# EAGLE design couch-reg-rc (EAGLE 7.6.0)
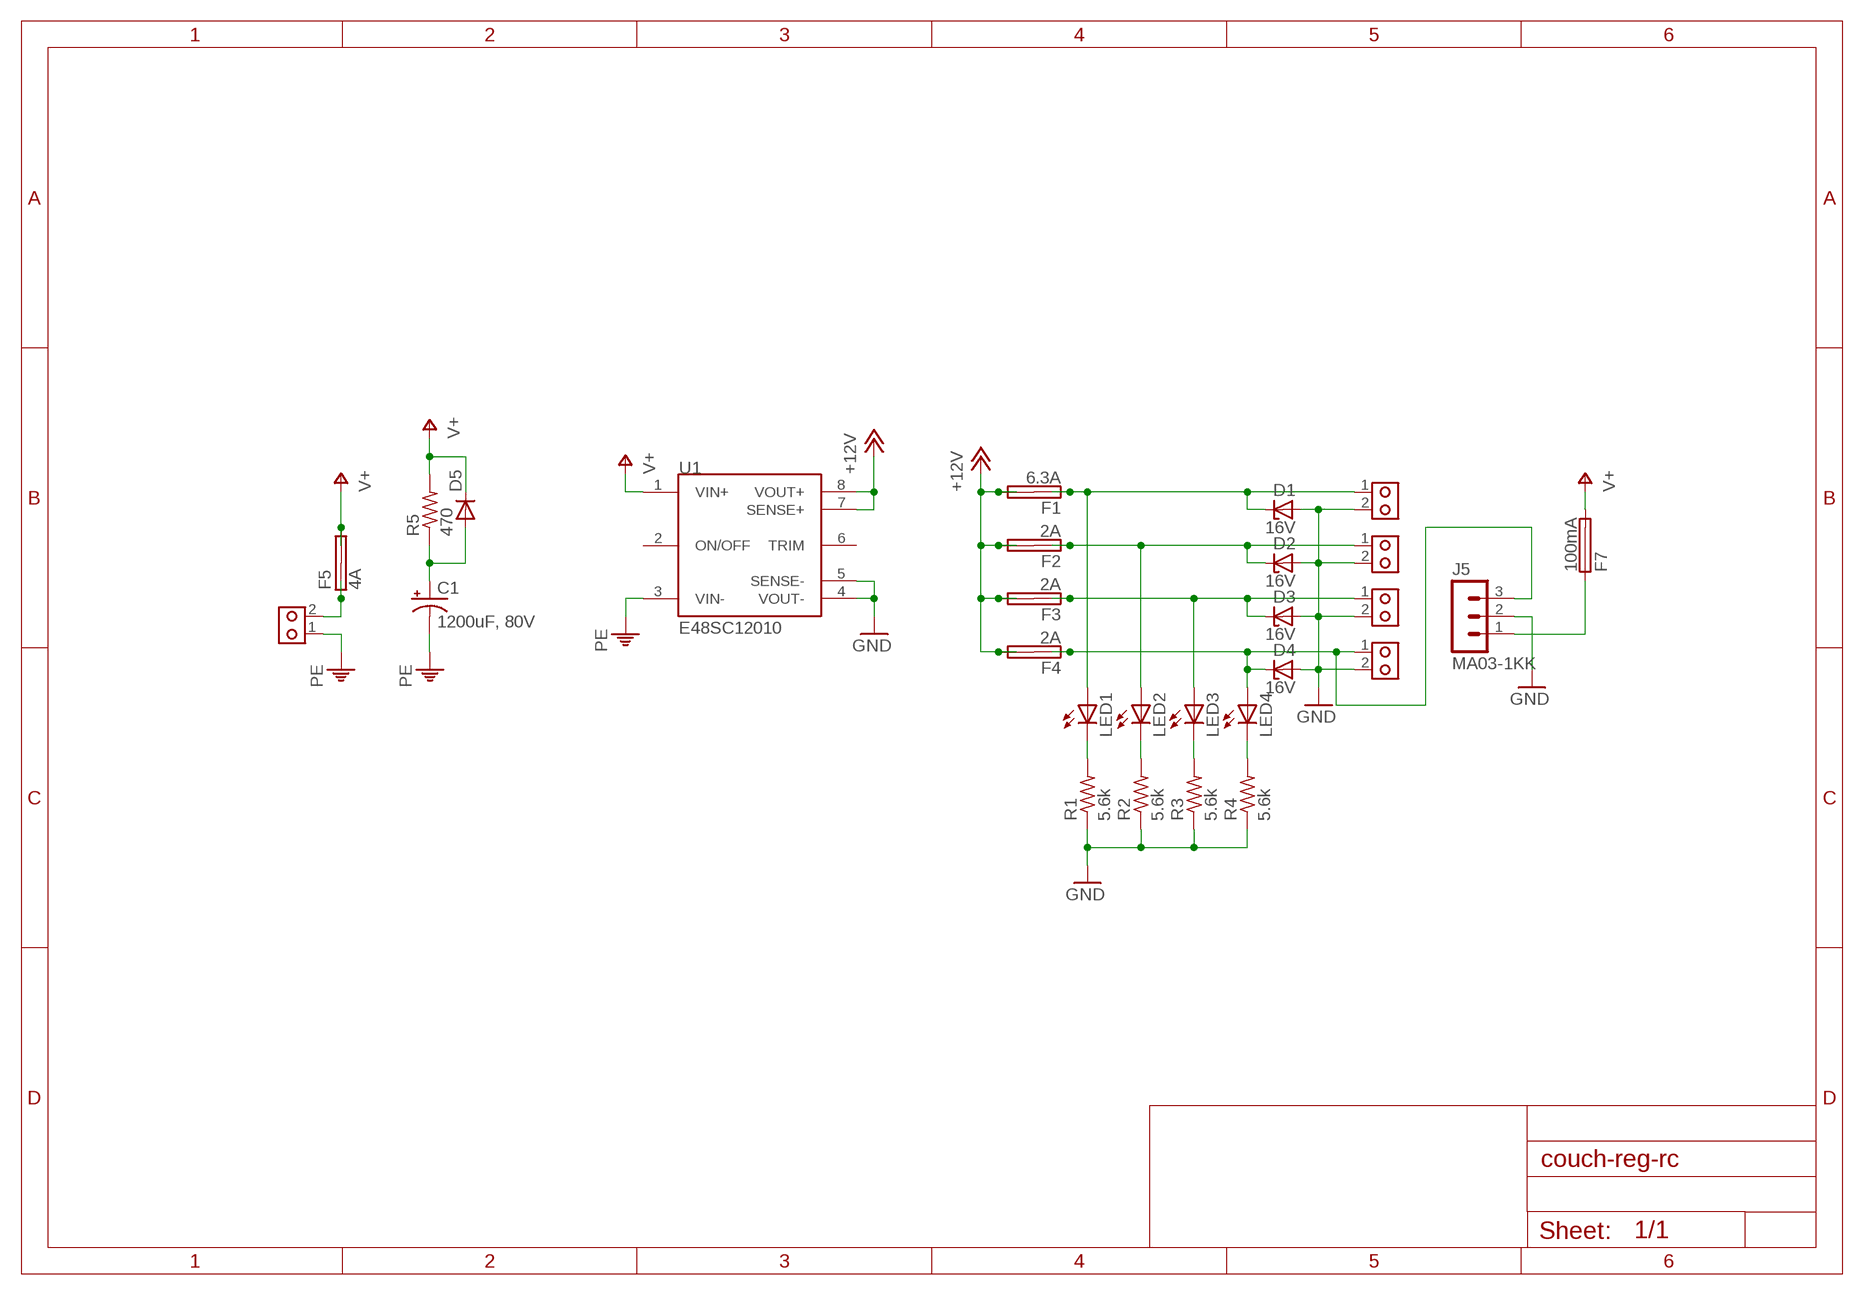
[diagram p0: schematic, sheet 1]

## Parts
C1  1200uF, 80V  CPOL-USE7.5-18  [E7,5-18]
D1  16V  ZENER-DIODEC1702-15  [C1702-15]
D2  16V  ZENER-DIODEC1702-15  [C1702-15]
D3  16V  ZENER-DIODEC1702-15  [C1702-15]
D4  16V  ZENER-DIODEC1702-15  [C1702-15]
D5  DIODE-SMB  [SMB]
F1  6.3A  SHK20L  [SHK20L]
F2  2A  SHK20L  [SHK20L]
F3  2A  SHK20L  [SHK20L]
F4  2A  SHK20L  [SHK20L]
F5  4A  SHK20L  [SHK20L]
F7  100mA  FUSE0603  [0603]
J1  PCBTERM2  [PCBTERM]
J2  PCBTERM2  [PCBTERM]
J3  PCBTERM2  [PCBTERM]
J4  PCBTERM2  [PCBTERM]
J5  MA03-1KK  [MOLEX-3]
J6  PCBTERM2  [PCBTERM]
LED1  LEDCHIPLED_0603  [CHIPLED_0603]
LED2  LEDCHIPLED_0603  [CHIPLED_0603]
LED3  LEDCHIPLED_0603  [CHIPLED_0603]
LED4  LEDCHIPLED_0603  [CHIPLED_0603]
R1  5.6k  R-US_R0603  [R0603]
R2  5.6k  R-US_R0603  [R0603]
R3  5.6k  R-US_R0603  [R0603]
R4  5.6k  R-US_R0603  [R0603]
R5  470  R-US_R0603  [R0603]
U1  E48SC12010  [E48SC12010]

## Nets
+12V: F1.2A F1.2B F2.2A F2.2B F3.2A F3.2B F4.2A F4.2B U1.7(SENSE+) U1.8(VOUT+)
GND: D1.A D2.A D3.A D4.A J1.2 J2.2 J3.2 J4.2 J5.2 R1.1 R2.1 R3.1 R4.1 U1.4(VOUT-) U1.5(SENSE-)
N$1: C1.+ D5.A R5.1
N$2: D4.C F4.1A F4.1B J4.1 J5.3 LED4.A
N$3: D1.C F1.1A F1.1B J1.1 LED1.A
N$4: D2.C F2.1A F2.1B J2.1 LED2.A
N$5: D3.C F3.1A F3.1B J3.1 LED3.A
N$7: F7.1 J5.1
N$8: LED1.C R1.2
N$9: LED2.C R2.2
N$10: LED3.C R3.2
N$11: LED4.C R4.2
N$12: F5.1A F5.1B J6.2
PE: C1.- J6.1 U1.3(VIN-)
V+: D5.C F5.2A F5.2B F7.2 R5.2 U1.1(VIN+)
Unconnected: U1.2(ON/OFF) U1.6(TRIM)

## Library data of the parts
C1 = resistor:CPOL-US: POLARIZED CAPACITOR, American symbol
D1-D4 = diode:ZENER-DIODE: Z-Diode
D5 = diode:DIODE-: DIODE
F1-F5 = fuse:SHK20L: FUSE HOLDER 5 x 20 mm, SH contact, SHH1 Schukat, E1073 Buerklin; OC_FARNELL: unknown; OC_NEWARK: unknown
F7 = william:FUSE
J1-J4 J6 = william:PCBTERM2
J5 = william:MA03-1
LED1-LED4 = led:LED: LED OSRAM: - CHIPLED LG R971, LG N971, LY N971, LG Q971, LY Q971, LO R971, LY R971 LH N974, LH R974 LS Q976, LO Q976, LY Q976 LO Q996 - Hyper CHIPLED LW Q18S LB Q993, LB Q99A, LB R99A - SideLED LS A670, LO A670, LY A670, LG A670, LP A670 LB A673, LV A673, LT A673, LW A673 LH A674 LY A675 LS A676, LA A676, LO A676, LY A676, LW A676 LS A679, LY A679, LG A679 - Hyper Micro SIDELED® LS Y876, LA Y876, LO Y876, LY Y876 LT Y87S - SmartLED LW L88C, LW L88S LB L89C, LB L89S, LG L890 LS L89K, LO L89K, LY L89K LS L896, LA L896, LO L896, LY L896 - TOPLED LS T670, LO T670, LY T670, LG T670, LP T670 LSG T670, LSP T670, LSY T670, LOP T670, LYG T670 LG T671, LOG T671, LSG T671 LB T673, LV T673, LT T673, LW T673 LH T674 LS T676, LA T676, LO T676, LY T676, LB T676, LH T676, LSB T676, LW T676 LB T67C, LV T67C, LT T67C, LS T67K, LO T67K, LY T67K, LW E67C LS E67B, LA E67B, LO E67B, LY E67B, LB E67C, LV E67C, LT E67C LW T67C LS T679, LY T679, LG T679 LS T770, LO T770, LY T770, LG T770, LP T770 LB T773, LV T773, LT T773, LW T773 LH T774 LS E675, LA E675, LY E675, LS T675 LS T776, LA T776, LO T776, LY T776, LB T776 LHGB T686 LT T68C, LB T68C - Hyper Mini TOPLED® LB M676 - Mini TOPLED Santana® LG M470 LS M47K, LO M47K, LY M47K Source: http://www.osram.convergy.de LUXEON: - LUMILED® LXK2-PW12-R00, LXK2-PW12-S00, LXK2-PW14-U00, LXK2-PW14-V00 LXK2-PM12-R00, LXK2-PM12-S00, LXK2-PM14-U00 LXK2-PE12-Q00, LXK2-PE12-R00, LXK2-PE12-S00, LXK2-PE14-T00, LXK2-PE14-U00 LXK2-PB12-K00, LXK2-PB12-L00, LXK2-PB12-M00, LXK2-PB14-N00, LXK2-PB14-P00, LXK2-PB14-Q00 LXK2-PR12-L00, LXK2-PR12-M00, LXK2-PR14-Q00, LXK2-PR14-R00 LXK2-PD12-Q00, LXK2-PD12-R00, LXK2-PD12-S00 LXK2-PH12-R00, LXK2-PH12-S00 LXK2-PL12-P00, LXK2-PL12-Q00, LXK2-PL12-R00 Source: www.luxeon.com KINGBRIGHT: KA-3528ASYC Source: www.kingbright.com
R1-R5 = resistor:R-US_: RESISTOR, American symbol
U1 = william:E48SC12010

## Board
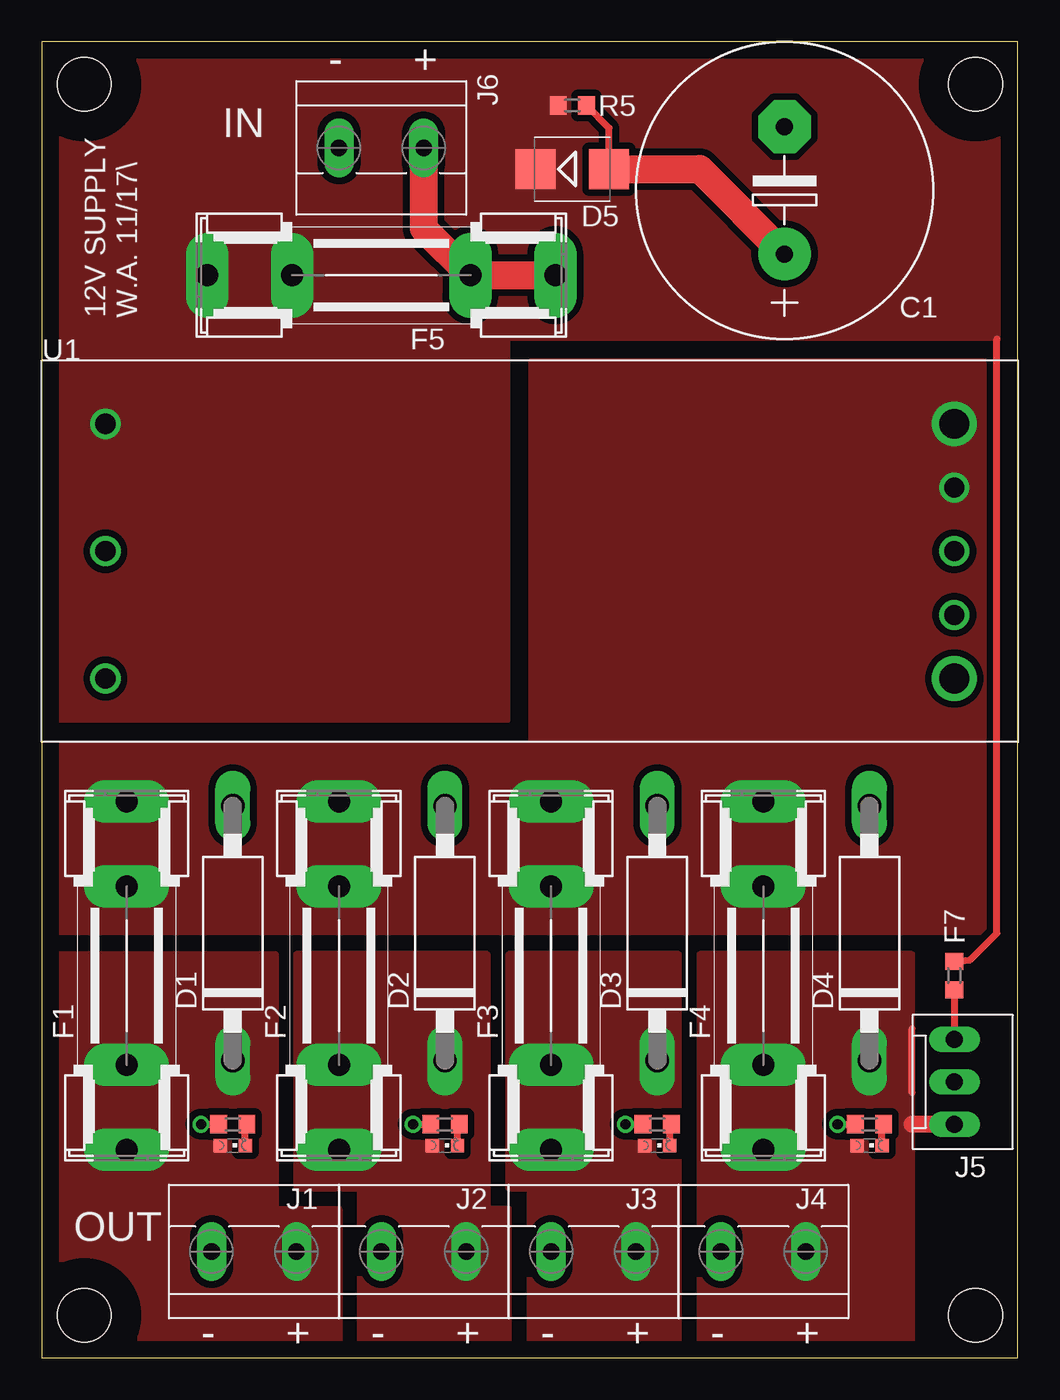
[diagram p1: board, top side]
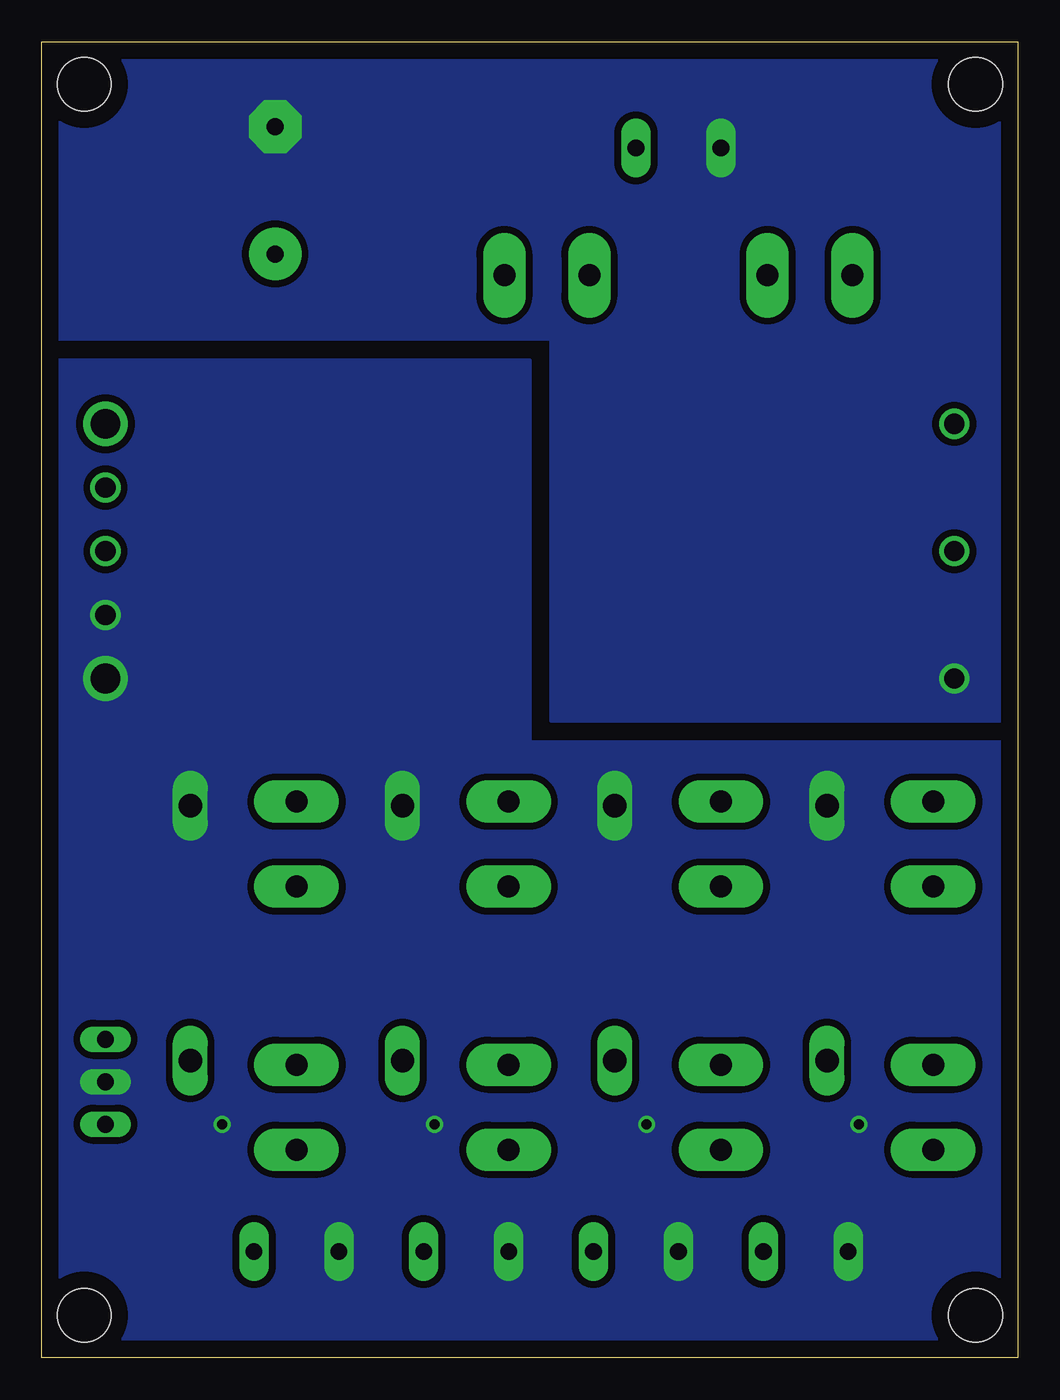
[diagram p2: board, bottom side, seen from below]

Size 58.42 x 78.74 mm. Coordinates in mm from the lower left corner, seen from the top.
Outline: 0,0 58.42,0 58.42,78.74 0,78.74 0,0
Copper layers (1*16): Top 0.035mm / dielectric 1.5mm / Bottom 0.035mm
Design rules "default *": minimum track width 8mil, minimum drill 0.3mm, track to track 8mil, track to pad 8mil, pad to pad 8mil, via to via 8mil, smd to smd 0mil, copper to edge 40mil, drill to drill 8mil, minimum pad ring 10mil, minimum via ring 8mil, stop-mask expansion 4mil, vias tented up to drill 25mil, thermal gap 10mil
Holes 3.2 mm at 2.54,76.2 55.88,76.2 2.54,2.54 55.88,2.54
tRestrict: area 1,1 to 4,4; area 54.4,1 to 57.4,4; area 54.4,74.7 to 57.4,77.7; area 1,74.7 to 4,77.7

### Footprints (pad centres in the part's own frame; a part is rotated, then mirrored left to right if it is on the bottom)
E7,5-18 = drill 1.016 pad 3.15: + -3.81,0 | drill 1.016 pad 3.15 octagon: - 3.81,0
C1702-15 = drill 1.397 long: A 7.62,0; C -7.62,0
SMB = smd 2.4 x 2.4: A 2.2,0; C -2.2,0
SHK20L = drill 1.321 pad 2.54 long: 1A -10.414,0; 1B -5.334,0; 2A 10.414,0; 2B 5.334,0
0603 = smd 1 x 1.1: 1 -0.85,0; 2 0.85,0
PCBTERM = drill 1 pad 1.778 long: 1 -2.54,0; 2 2.54,0
MOLEX-3 = drill 1.016 long: 1 2.54,0; 2 0,0; 3 -2.54,0
CHIPLED_0603 = smd 0.8 x 0.8: A 0,-0.75; C 0,0.75
R0603 = smd 1 x 1.1: 1 -0.85,0; 2 0.85,0
E48SC12010 = drill 1.2: 1 -25.4,7.62; 2 -25.4,0; 3 -25.4,-7.62; 5 25.4,-3.81; 6 25.4,0; 7 25.4,3.81 | drill 1.778: 4 25.4,-7.62; 8 25.4,7.62

### Placement (x,y rotation side)
C1  44.45,69.85 90 top
D1  11.43,25.4 90 top
D2  24.13,25.4 90 top
D3  36.83,25.4 90 top
D4  49.53,25.4 90 top
D5  31.75,71.12 0 top
F1  5.08,22.86 90 top
F2  17.78,22.86 90 top
F3  30.48,22.86 90 top
F4  43.18,22.86 90 top
F5  20.32,64.77 180 top
F7  54.61,22.86 90 top
J1  12.7,6.35 180 top
J2  22.86,6.35 180 top
J3  33.02,6.35 180 top
J4  43.18,6.35 180 top
J5  54.61,16.51 90 top
J6  20.32,72.39 0 top
LED1  11.43,12.7 270 top
LED2  24.13,12.7 270 top
LED3  36.83,12.7 270 top
LED4  49.53,12.7 270 top
R1  11.43,13.97 0 top
R2  24.13,13.97 0 top
R3  36.83,13.97 0 top
R4  49.53,13.97 0 top
R5  31.75,74.93 180 top
U1  29.21,48.26 0 top

### Tracks (layer width: path | path; a pad name or v marks a point on that pad's centre or on a via)
+12V
  pour Top (isolate 0.406, no thermals): 0,25.4 58.42,25.4 58.42,59.69 29.21,59.69 29.21,36.83 0,36.83
GND  (via drill 0.6)
  Top 0.406: v22.23,13.97 R2.1 | v34.92,13.97 R3.1 | v47.62,13.97 R4.1 | v9.53,13.97 R1.1
  pour Bottom (isolate 0.406, no thermals): 0,0 58.42,0 58.42,59.69 29.21,59.69 29.21,36.83 0,36.83
N$1
  Top 0.406: D5.A 33.95,73.58 R5.1
  Top 1.676: D5.A 39.37,71.12 C1.+
N$2
  Top 0.406: 52.07,15.88 52.07,19.68
  Top 1.016: J5.3 52.07,13.97
  pour Top (isolate 0.406, no thermals): 39.37,24.13 39.37,0 52.07,0 52.07,24.13
N$3
  pour Top (isolate 0.406, no thermals): 0,24.13 13.97,24.13 13.97,10.16 13.97,8.89 17.78,8.89 17.78,0 0,0
N$4
  pour Top (isolate 0.406, no thermals): 15.24,24.13 15.24,10.16 19.05,10.16 19.05,1.27 19.05,0 27.94,0 27.94,8.89 26.67,8.89 26.67,24.13
N$5
  pour Top (isolate 0.406, no thermals): 27.94,24.13 27.94,10.16 29.21,10.16 29.21,1.27 29.21,0 38.1,0 38.1,24.13
N$7
  Top 0.406: F7.1 J5.1
N$8
  Top 0.406: LED1.C 12.18,13.87 R1.2
N$9
  Top 0.406: LED2.C 24.88,13.87 R2.2
N$10
  Top 0.406: LED3.C 37.58,13.87 R3.2
N$11
  Top 0.406: LED4.C 50.28,13.87 R4.2
N$12
  Top 1.676: J6.2 22.86,67.56 F5.1B F5.1A
PE
  pour Bottom (isolate 0.406, no thermals): 0,38.1 0,78.74 58.42,78.74 58.42,60.96 27.94,60.96 27.94,38.1
V+
  Top 0.406: F7.2 55.56,23.81 57.15,25.4 57.15,60.96
  pour Top (isolate 0.406, no thermals): 0,38.1 27.94,38.1 27.94,60.96 58.42,60.96 58.42,78.74 0,78.74

### Text on the board
tPlace: - | + | IN | 12V SUPPLY | W.A. 11/17\ | OUT | - | + | - | + | - | + | - | +